# Altium schematic sheet Schematic.SchDoc
size A; SheetNumber: 1; SheetTotal: 1
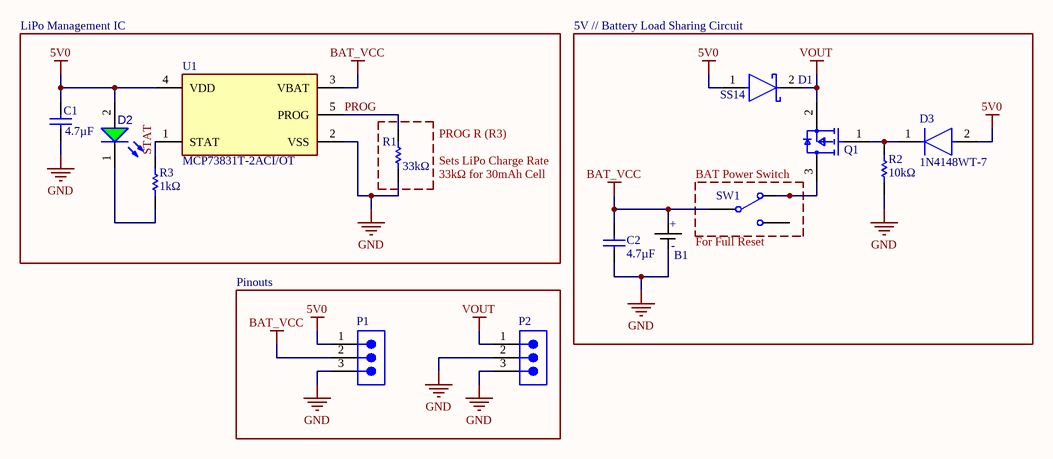
[diagram p0: Schematic.SchDoc]

## Parts
B1  LiPo  (value not drawn)
C1  4.7µF  [CAPC1206(3216)190_L]
C2  4.7µF  [CAPC1206(3216)190_L]
D1  SS14  [FP-403AE-MFG]
D2  150120GS75000  [WL-SMCW_1206_150120xx75000]  (value not drawn)
D3  1N4148WT-7  [FP-SOD523-MFG]
P1  61300311121  [61300311121]  (value not drawn)
P2  61300311121  [61300311121]  (value not drawn)
Q1  IRLML6402TRPBF  [FP-Micro3-MFG]  (value not drawn)
R1  33kΩ  [RESC3116X65X40LL10T20]
R2  10kΩ  [RESC3116X65X40LL10T20]
R3  1kΩ  [RESC3116X65X40LL10T20]
SW1  450404015514  [450404015514]  (value not drawn)
U1  MCP73831T-2ACI/OT  [FP-C04-091-OT-IPC_B]

## Blocks framed on the sheet
BAT Power Switch: SW1
Pinouts: P1 P2

## Nets
5V0: C1.2 D1.1(A) D2.2(A) D3.2(A) P1.1 U1.4(VDD)
BAT_VCC: B1.0(+) C2.2 P1.2 SW1.COM U1.3(VBAT)
GND: B1.1(-) C1.1 C2.1 P1.3 P2.2 P2.3 R1.1 R2.1 U1.2(VSS)
VOUT: D1.2(C) P2.1 Q1.2(S)
PROG: R1.2 U1.5(PROG)
STAT: R3.1 U1.1(STAT)
NetD2_1: D2.1(K) R3.2
NetD3_1: D3.1(C) Q1.1(G) R2.2
NetQ1_3: Q1.3(D) SW1.L1

Not connected (* = marked no-connect by the designer): SW1 L2

## Notes on the sheet
- LiPo Management IC
- 5V // Battery Load Sharing Circuit
- (near R1) PROG R (R3)
- (near R1) Sets LiPo Charge Rate
- (near R1) 33kΩ for 30mAh Cell
- (near SW1) For Full Reset

## Library data of the parts
B1 = 3.7V 30mAh LiPo
C1 C2 = CMP-1037-04917-1: CAP 4.7uF 25V ±5% 1206 (3216 Metric) Thickness 1.9mm SMD; Tolerance: Â±5%; Case-Metric: 3216; Case-EIA: 1206; Max Thickness: 1.9 mm; Rated Voltage: 25 V; Value: 4.7uF; Technology: SMT
D1 = CMP-2000-04943-2: DIODE SCHOTTKY 40V 1A SMA; Manufacturer: ON Semiconductor; Peak Reverse Current: 0.2mA; Max Junction Temp: +125°C; Standoff Height: 0.05mm; Max Surge Forward Current: 40A; Mouser Description: Schottky Diodes & Rectifiers SMA 40V 1.0A; RoHS: TRUE; Lead Free: Yes; Manufacturer Part Number: SS14; Device Class L3: Schottky Diodes; Category: Diode; Automotive: No; Digikey Description: DIODE SCHOTTKY 40V 1A SMA; ComponentLink2Description: Datasheet; Device Class L2: Diodes; Height: 2.5mm; Temperature Range High: +125°C; ComponentLink2URL: https://www.onsemi.com/pub/Collateral/SS19-D.PDF; Device Class L1: Discrete Semiconductors; Package: 403AE; Octopart: https://octopart.com/ss14-on+semiconductor-29205033; Max Repetitive Reverse Voltage: 40V; Temperature Range Low: -65°C; Forward Current: 1A; Temperature: -65°C to +125°C
D2 = CMP-1426-00014-4: WL-SMCW SMT Mono-Color Chip LED Waterclear; Dominant Wavelength: 525nm; Reverse Voltage: 5V; Max Junction Temperature (Tj): 95°C; Lens Style: Clear, Rectangular; Forward Voltage: 3.2V; Power Dissipation: 105mW; Peak Wavelength: 515nm; Test Current: 20mA; Color: Green; Forward Current: 100mA; Luminous Intensity: 450mcd; Viewing Angle: 140°; Case Code (Imperial): 1206; REACH SVHC: Unknown; Packaging: Tape and Reel; Max Operating Temperature: 85°C; Case/Package: 1206; Height: 680µm; Length: 3.2mm; Mount: Surface Mount; Min Operating Temperature: -40°C; Width: 1.6mm; Case Code (Metric): 3216; Max Reverse Voltage (DC): 5V; RoHS: Compliant; Wavelength: 525nm
D3 = CMP-2000-05518-3: DIODE GEN PURP 80V 125MA SOD523; Power Rating: 150mW; Peak Non-Repetitive Surge Current: 2A; Forward Voltage: 1.25V; Reverse Recovery Time: 4ns; Peak Reverse Current: 1uA; Max Repetitive Reverse Voltage (Vrrm): 100V; Capacitance: 2pF; Polarity: Standard; Element Configuration: Single; Forward Current: 250mA; Lead Free: Lead Free; Packaging: Tape and Reel; Length: 0.9mm; Min Operating Temperature: -65°C; Current Rating: 125mA; Max Reverse Voltage (DC): 80V; Width: 1.3mm; Package Quantity: 3000; Output Current: 125mA; Power Dissipation: 150mW; Max Operating Temperature: 150°C; Radiation Hardening: No; Average Rectified Current: 125mA; Height: 0.65mm; Voltage Rating (DC): 80V; Max Surge Current: 2A; Weight: 3.5E-05oz; Recovery Time: 4ns; Max Forward Surge Current (Ifsm): 2A; Contact Plating: Tin; Number of Pins: 2; Mount: Surface Mount; REACH SVHC: No SVHC
P1 P2 = CMP-1502-01062-3: NexarPartId: 32855521; Current Rating: 3A; Voltage Rating: 250V; Number of Positions: 3; Pitch: 2.54mm; Contact Resistance: 20mΩ; Connector Type: Male Pin; Gender: Male; REACH SVHC: Unknown; Packaging: Bulk; Contact Material: Copper; Min Operating Temperature: -40°C; Number of Rows: 1; Orientation: Vertical; RoHS: Compliant; Contact Plating: Gold; Max Operating Temperature: 105°C; Mount: Through Hole; Height: 8.94mm; Operating Supply Voltage: 250V; Number of Pins: 3; Contact Mating Length: 5.9944mm; Number of Contacts: 3; Color: Black; Lead Free: Lead Free; Lead Pitch: 2.54mm; Termination: Solder
Q1 = CMP-32901-000130-1: MOSFET P-CH 20V 3.7A SOT-23; Manufacturer: Infineon; Reverse Recovery Time: 29ns; Max Forward Diode Voltage: -1.2V; Input Capacitace At Vds: 633pF @ -10V; Drain To Source Resistance: 0.05Ω; Gate To Source Voltage: 12V; Max Junction Temp: +150°C; Pulse Drain Current: -22A; Threshold Vgs Min: -0.4V; Turn Off Delay Time: 588ns; Number Of Channels: 1; Power Dissipation: 1.3W; Turn On Delay Time: 350ns; Drain To Source Breakdown Voltage: -20V; Continuous Drain Current: -3.7A; Depletion Mode: False; Gate Charge At Vgs: 8nC @ -5V; Rthja Max: 75°C/W; Threshold Vgs: -0.55V; Standoff Height: 0.01mm; Reverse Recovery Charge: 11nC; Device Class L2: Transistors; Ipc Land Pattern Name: SOT95P237X100-3; Temperature Range High: +150°C; Octopart: https://octopart.com/irlml6402trpbf-infineon-65874989; ComponentLink2URL: https://www.infineon.com/dgdl/irlml6402pbf.pdf?fileId=5546d462533600a401535668d5c2263c; Automotive: No; Manufacturer Part Number: IRLML6402TRPBF; Height: 1.12mm; Drain To Source Voltage: -20V; Digikey Description: MOSFET P-CH 20V 3.7A SOT-23; Device Class L1: Discrete Semiconductors; Package: Micro3; Lead Free: Yes; Temperature Range Low: -55°C; Number Of P Channels: 1; Technology: MOSFET; Temperature: -55°C to +150°C; Category: Trans; Footprint Url: http://irf.com/package/outline/po_micro3.pdf; RoHS: TRUE; Device Class L3: MOSFETs; Threshold Vgs Max: -1.2V; ComponentLink2Description: Datasheet
R1 = CMP-2003-03510-1: Part Number: RC1206JR-1033KL; Manufacturer: Yageo
R2 = CMP-1014-00623-2: Chip Resistor, 10 KOhm, +/- 1%, 0.25 W, -55 to 155 degC, 1206 (3216 Metric), RoHS, Tape and Reel; Manufacturer: Yageo; Voltage Rating: 200V; Resistance: 10KOhm; Temperature Coefficient: 100ppm/degreesC; Power Rating: 250mW; Packaging: TapeandReel; Termination: SMD/SMT; REACH SVHC: Unknown; Tolerance: 1%; Height: 0.55mm; Composition: ThickFilm; Max Operating Temperature: 155degC; Datasheet Version: Rev. 5, 10/2016; Lead Free: LeadFree; Case Code (Metric): 3216; Depth: 1.6mm; Package Quantity: 5000; RoHSCompliant: true; Military Standard: Not; Case/Package: 1206; Case Code (Imperial): 1206; Min Operating Temperature: -55degC; Datasheet URL: http://www.yageo.com/NewPortal/yageodocoutput?fileName=/pdf/R-Chip/PYu-RC_Group_51_RoHS_L_5.pdf; Length: 3.1mm; Manufacturer URL: http://www.yageo.com/; Package Reference: 1206.0; Width: 1.6mm; Package Description: 2-Pin Surface Mount Device, Body 3.1 x 1.6 mm
R3 = CMP-2100-03678-1: Chip Resistor, 1 KOhm, +/- 1%, 0.25 W, -55 to 155 degC, 1206 (3216 Metric), RoHS, Tape and Reel; Manufacturer: Yageo; Temperature Coefficient: 100ppm/degreesC; Power Rating: 250mW; Voltage Rating: 200V; Resistance: 1KOhm; Composition: ThickFilm; Min Operating Temperature: -55degC; Tolerance: 1%; REACH SVHC: Unknown; Case Code (Metric): 3216; Military Standard: Not; Datasheet Version: Rev. 5, 10/2016; Package Reference: 1206.0; Case/Package: 1206; Length: 3.1mm; Manufacturer URL: http://www.yageo.com/; Lead Free: LeadFree; RoHSCompliant: true; Termination: SMD/SMT; Packaging: TapeandReel; Package Description: 2-Pin Surface Mount Device, Body 3.1 x 1.6 mm; Depth: 1.6mm; Case Code (Imperial): 1206; Max Operating Temperature: 155degC; Datasheet URL: http://www.yageo.com/NewPortal/yageodocoutput?fileName=/pdf/R-Chip/PYu-RC_Group_51_RoHS_L_5.pdf; Height: 0.55mm
SW1 = CMP-03913-99472344-1: 450404015514 Slide Switch, 0.3A, 5Vdc, Smd Rohs Compliant: Yes; Current Rating: 300mA; Insulation Resistance: 100MΩ; Voltage Rating: 5V; NexarPartId: 99472344; Min Operating Temperature: -40°C; Contact Plating: Silver; Packaging: Tape and Reel; Max Operating Temperature: 85°C; RoHS: Compliant
U1 = CMP-0133-00143-2: IC CONTROLLR LI-ION 4.2V SOT23-5; Max Power Dissipation: 1.54W; Output Current: 500mA; Max Output Voltage: 4.5V; Number of Outputs: 1; Min Output Voltage: 4.168V; Min Supply Voltage: 3.75V; Max Input Voltage: 6V; Voltage Rating: 4.534V; Drain to Source Resistance: 350mR; Max Operating Temperature: 85°C; Length: 0.122inch; Number of Pins: 5; REACH SVHC: No SVHC; Radiation Hardening: No; Min Operating Temperature: -40°C; Weight: 0.00709oz; Contact Plating: Tin; Termination: SMD/SMT; Case/Package: SOT-23; Mount: Surface Mount; Width: 0.071inch; Packaging: Tape and Reel; Number of Cells: 1; Max Charge Current: 500mA; Height: 0.051inch; Number of Channels: 1; Output Voltage: 4.2V; Max Supply Voltage: 6V; Lead Free: Lead Free